# Altium schematic sheet 07_PCIE_WIFI.SchDoc
size 386 x 246 mm
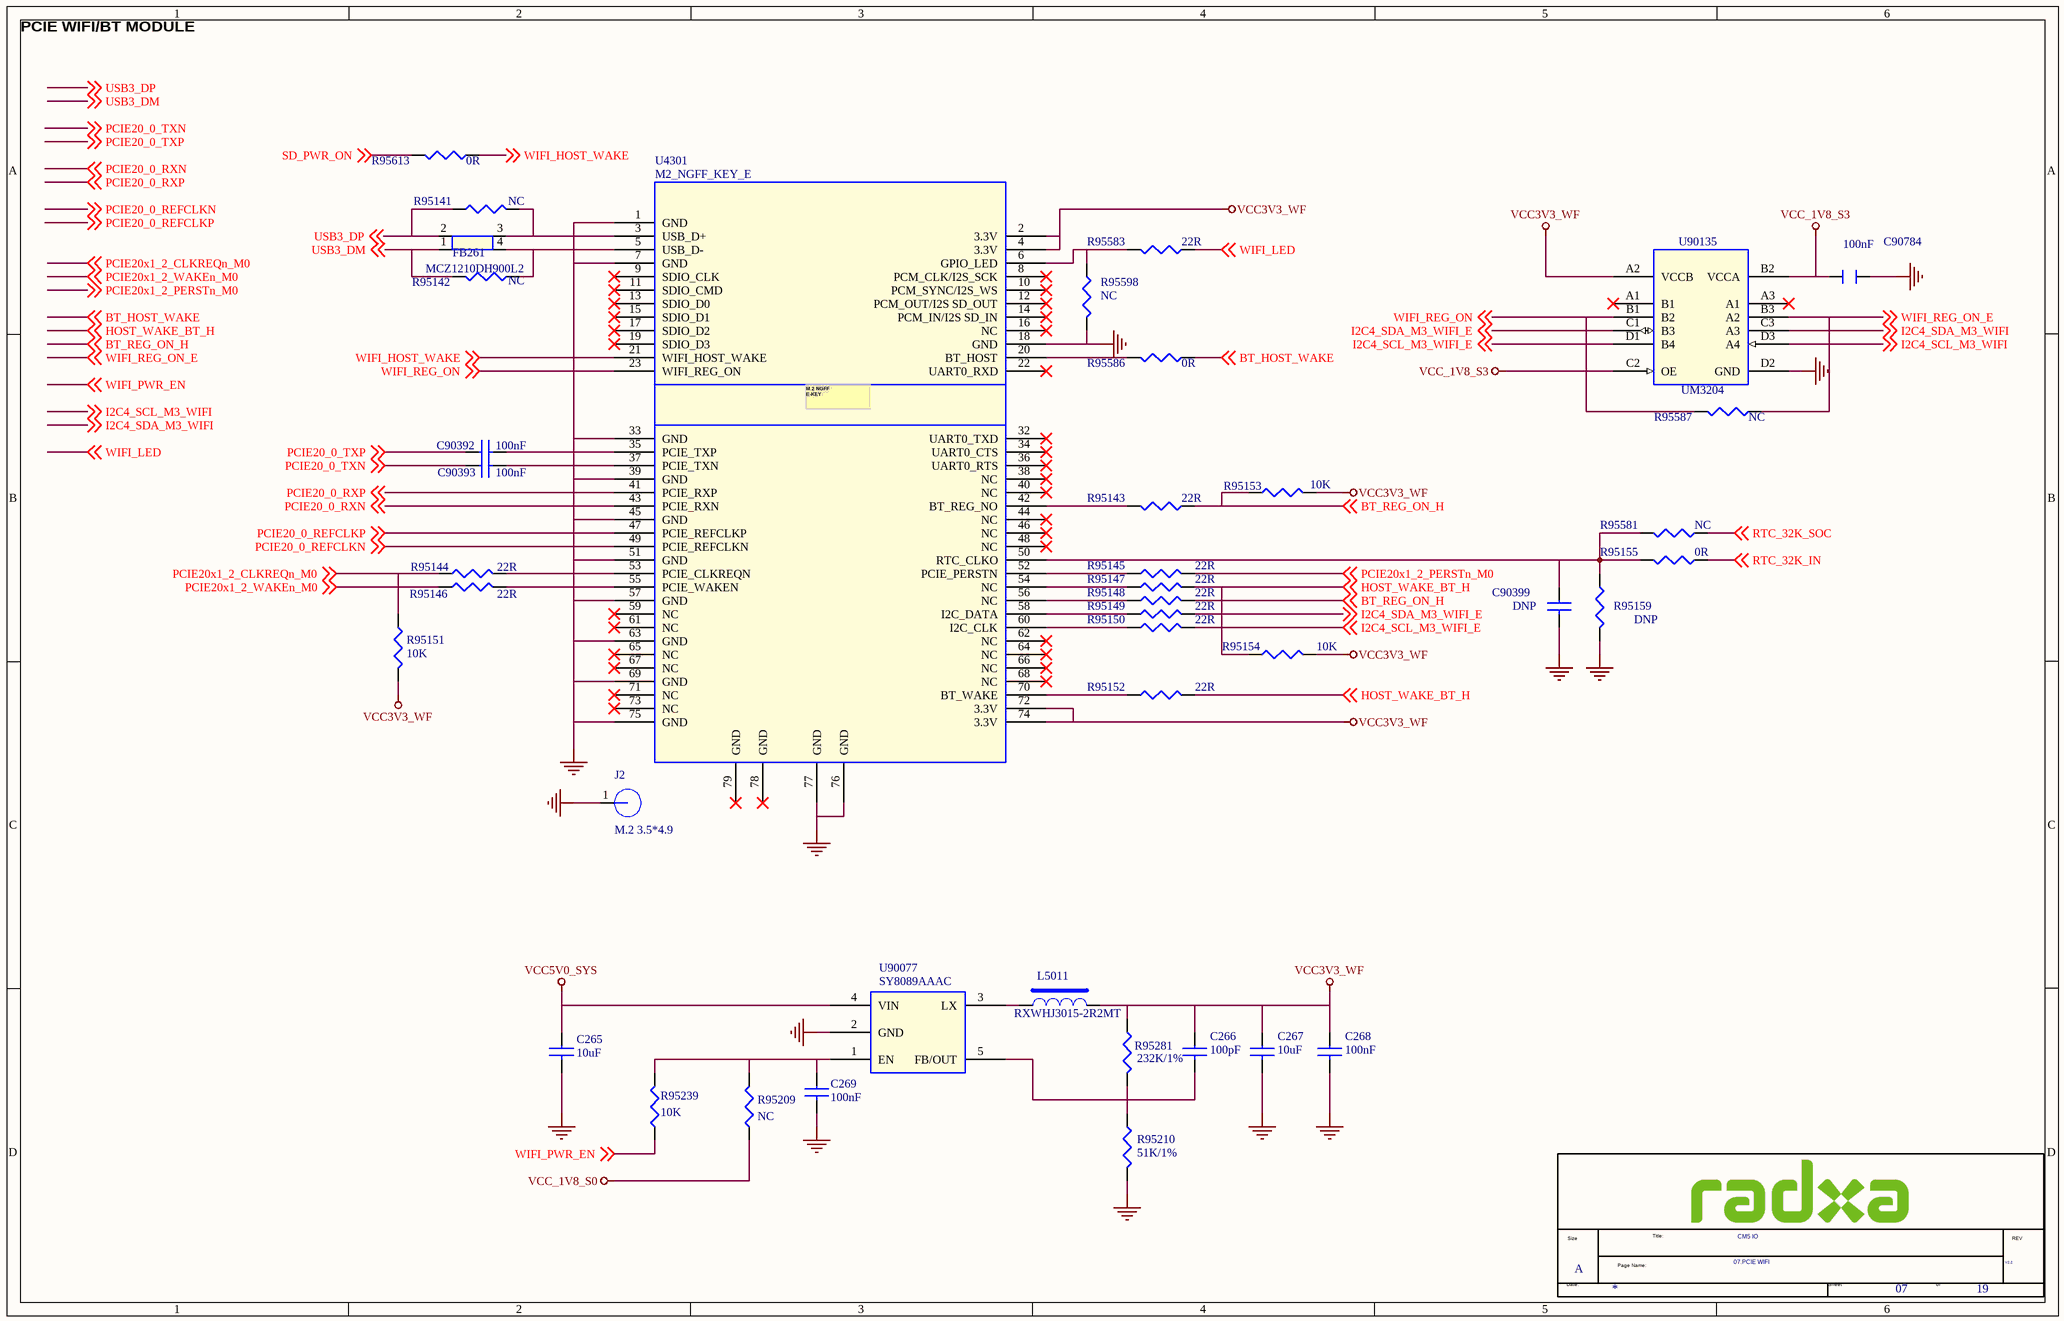
[diagram p0: 07_PCIE_WIFI.SchDoc]

## Parts
*  Doc: 07.PCIE WIFI  RevCode: V2.2  Title: CM5 IO  Page Size: A  Page Number: 07  Page Count: 19  (hidden comment: radxa_1010)  (graphical)
C265  10uF  [C0603]
C266  100pF  [C0201]
C267  10uF  [C0603]
C268  100nF  [C0201]
C269  100nF  [C0201]
C90392  100nF  [C0201]
C90393  100nF  [C0201]
C90399  DNP  [C0402]
C90784  100nF  [C0402]
FB261  MCZ1210DH900L2  [MCZ1210AH900L2]
J2  M.2 3.5*4.9  [H3.8MM]
L5011  RXWHJ3015-2R2MT  [IND_303015]
R95141  NC  [R0402]
R95142  NC  [R0402]
R95143  22R  [R0402]
R95144  22R  [R0402]
R95145  22R  [R0402]
R95146  22R  [R0402]
R95147  22R  [R0402]
R95148  22R  [R0402]
R95149  22R  [R0402]
R95150  22R  [R0402]
R95151  10K  [R0402]
R95152  22R  [R0402]
R95153  10K  [R0402]
R95154  10K  [R0402]
R95155  0R  [R0402]
R95159  DNP  [R0402]
R95209  NC  [R0402]
R95210  51K/1%  [R0402]
R95239  10K  [R0402]
R95281  232K/1%  [R0402]
R95581  NC  [R0402]
R95583  22R  [R0402]
R95586  0R  [R0402]
R95587  NC  [R0402]
R95598  NC  [R0402]
R95613  0R  [R0402]
U4301  M2_NGFF_KEY_E  [M2_NGFF_KEY_E_1]
U90077  SY8089AAAC  [SOT_23_5]
U90135  UM3204  [CSP-12]

## Nets
GND: C265.2 C267.2 C268.2 C269.2 C90399.2 C90784.1 J2.1 R95159.2 R95210.2 R95598.2 U4301.1(GND) U4301.7(GND) U4301.18(GND) U4301.33(GND) U4301.39(GND) U4301.45(GND) U4301.51(GND) U4301.57(GND) U4301.63(GND) U4301.69(GND) U4301.75(GND) U4301.76(GND) U4301.77(GND) U90077.2(GND) U90135.D2(GND)
VCC3V3_WF: C266.1 C267.1 C268.1 L5011.2 R95151.2 R95153.2 R95154.2 R95281.1 U4301.2(3.3V) U4301.4(3.3V) U4301.72(3.3V) U4301.74(3.3V) U90135.A2(VCCB)
VCC5V0_SYS: C265.1 U90077.4(VIN)
VCC_1V8_S0: R95209.1
VCC_1V8_S3: C90784.2 U90135.B2(VCCA) U90135.C2(OE)
BT_HOST_WAKE: R95586.1 ; off-sheet BT_HOST_WAKE
BT_REG_ON_H: R95143.1 R95148.1 R95153.1 ; off-sheet BT_REG_ON_H
HOST_WAKE_BT_H: R95147.1 R95152.1 R95154.1 ; off-sheet HOST_WAKE_BT_H
I2C4_SCL_M3_WIFI: U90135.D3(A4) ; off-sheet I2C4_SCL_M3_WIFI
I2C4_SCL_M3_WIFI_E: R95150.1 U90135.D1(B4) ; off-sheet I2C4_SCL_M3_WIFI_E
I2C4_SDA_M3_WIFI: U90135.C3(A3) ; off-sheet I2C4_SDA_M3_WIFI
I2C4_SDA_M3_WIFI_E: R95149.1 U90135.C1(B3) ; off-sheet I2C4_SDA_M3_WIFI_E
PCIE20_0_REFCLKN: U4301.49(PCIE_REFCLKN) ; off-sheet PCIE20_0_REFCLKN
PCIE20_0_REFCLKP: U4301.47(PCIE_REFCLKP) ; off-sheet PCIE20_0_REFCLKP
PCIE20_0_RXN: U4301.43(PCIE_RXN) ; off-sheet PCIE20_0_RXN
PCIE20_0_RXP: U4301.41(PCIE_RXP) ; off-sheet PCIE20_0_RXP
PCIE20_0_TXN: C90393.1 ; off-sheet PCIE20_0_TXN
PCIE20_0_TXP: C90392.1 ; off-sheet PCIE20_0_TXP
PCIE20x1_2_CLKREQn_M0: R95144.1 R95151.1 ; off-sheet PCIE20x1_2_CLKREQn_M0
PCIE20x1_2_PERSTn_M0: R95145.1 ; off-sheet PCIE20x1_2_PERSTn_M0
PCIE20x1_2_WAKEn_M0: R95146.1 ; off-sheet PCIE20x1_2_WAKEn_M0
RTC_32K_IN: R95155.1 ; off-sheet RTC_32K_IN
RTC_32K_SOC: R95581.1 ; off-sheet RTC_32K_SOC
SD_PWR_ON: R95613.2 ; off-sheet SD_PWR_ON
USB3_DM: FB261.1 R95142.2 ; off-sheet USB3_DM
USB3_DP: FB261.2 R95141.2 ; off-sheet USB3_DP
WIFI_HOST_WAKE: R95613.1 U4301.21(WIFI_HOST_WAKE) ; off-sheet WIFI_HOST_WAKE
WIFI_LED: R95583.1 ; off-sheet WIFI_LED
WIFI_PWR_EN: R95239.1 ; off-sheet WIFI_PWR_EN
WIFI_REG_ON: R95587.2 U4301.23(WIFI_REG_ON) U90135.B1(B2) ; off-sheet WIFI_REG_ON
WIFI_REG_ON_E: R95587.1 U90135.B3(A2) ; off-sheet WIFI_REG_ON_E
NetC266_2: C266.2 R95210.1 R95281.2 U90077.5(FB/OUT)
NetC269_1: C269.1 R95209.2 R95239.2 U90077.1(EN)
NetC90392_2: C90392.2 U4301.35(PCIE_TXP)
NetC90393_2: C90393.2 U4301.37(PCIE_TXN)
NetC90399_1: C90399.1 R95155.2 R95159.1 R95581.2 U4301.50(RTC_CLKO)
NetFB261_3: FB261.3 R95141.1 U4301.3(USB_D+)
NetFB261_4: FB261.4 R95142.1 U4301.5(USB_D-)
NetL5011_1: L5011.1 U90077.3(LX)
NetR95143_2: R95143.2 U4301.42(BT_REG_NO)
NetR95144_2: R95144.2 U4301.53(PCIE_CLKREQN)
NetR95145_2: R95145.2 U4301.52(PCIE_PERSTN)
NetR95146_2: R95146.2 U4301.55(PCIE_WAKEN)
NetR95147_2: R95147.2 U4301.54(NC)
NetR95148_2: R95148.2 U4301.56(NC)
NetR95149_2: R95149.2 U4301.58(I2C_DATA)
NetR95150_2: R95150.2 U4301.60(I2C_CLK)
NetR95152_2: R95152.2 U4301.70(BT_WAKE)
NetR95583_2: R95583.2 R95598.1 U4301.6(GPIO_LED)
NetR95586_2: R95586.2 U4301.20(BT_HOST)

Not connected (* = marked no-connect by the designer): U4301 8(PCM_CLK/I2S_SCK)* 9(SDIO_CLK)* 10(PCM_SYNC/I2S_WS)* 11(SDIO_CMD)* 12(PCM_OUT/I2S_SD_OUT)* 13(SDIO_D0)* 14(PCM_IN/I2S_SD_IN)* 15(SDIO_D1)* 16(NC)* 17(SDIO_D2)* 19(SDIO_D3)* 22(UART0_RXD)* 32(UART0_TXD)* 34(UART0_CTS)* 36(UART0_RTS)* 38(NC)* 40(NC)* 44(NC)* 46(NC)* 48(NC)* 59(NC)* 61(NC)* 62(NC)* 64(NC)* 65(NC)* 66(NC)* 67(NC)* 68(NC)* 71(NC)* 73(NC)* 78(GND)* 79(GND)*; U90135 A1(B1)* A3(A1)*

## Notes on the sheet
- PCIE WIFI/BT MODULE
- (in symbol M_8.2 NGFF EKEY SOCKET) M.2 NGFF / E-KEY
- (in symbol radxa_1010) Size; Title:; REV; Page Name:; Date:; Sheet; of

## Library data of the parts
C265 C267 = CAP NP_0_Dup5: cap,10.00uF,+/-10%,10V,X5R,C0805; Manufacturer: TDK; Voltage: 6.3V; RK PN: C2012X5R1A106K125AB; Priority: A; Tolerance: 10%; PCB Footprint: C0603; Dielectric: X5R; Part Type: C0805; Manufacturer PN: C2012X5R1A106K125AB; Created by: JJJ
C266 = CAP NP_0_Dup5: cap,100.00pF,+/-5%,50V,C0G,C0402; Manufacturer: TDK; Voltage: 25V; RK PN: C1005C0G1H101J050BA; Priority: A; Tolerance: 5%; PCB Footprint: C0201; Dielectric: C0G; Part Type: C0402; Manufacturer PN: C1005C0G1H101J050BA; Created by: JJJ
C268 = CAP NP_0_Dup5: cap,100.00nF,+/-10%,16V,X5R,C0402; Manufacturer: TDK; RK PN: C1005X5R1C104K050BA; Priority: A; Tolerance: 10%; Voltage: 16V; PCB Footprint: C0201; Dielectric: X5R; Part Type: C0402; Manufacturer PN: C1005X5R1C104K050BA; Created by: JJJ
C269 = CAP NP_0_Dup5: cap,100.00nF,+/-10%,16V,X5R,C0402; Manufacturer PN: C1005X5R1C104K050BA; Manufacturer: TDK; Tolerance: 10%; Priority: A; Voltage: 16V; PCB Footprint: C0201; Dielectric: X5R; Created by: JJJ; Part Type: C0402; RK PN: C1005X5R1C104K050BA
C90392 = CAP NP_0_Dup5: cap,100.00nF,+/-10%,10V,X5R,C0201; Manufacturer: TDK; RK PN: C0603X5R1A104K030BC; Priority: A; Tolerance: 10%; Voltage: 10V; PCB Footprint: C0201; Dielectric: X5R; Part Type: C0201; Manufacturer PN: C0603X5R1A104K030BC; Created by: JJJ
C90393 = CAP NP_0_Dup5: cap,100.00nF,+/-10%,10V,X5R,C0201; Manufacturer PN: C0603X5R1A104K030BC; Manufacturer: TDK; Tolerance: 10%; Priority: A; Voltage: 10V; PCB Footprint: C0201; Dielectric: X5R; Created by: JJJ; Part Type: C0201; RK PN: C0603X5R1A104K030BC
C90399 = CAP NP_0_Dup5: Did Not Place.; Manufacturer PN: DNPC0402; Priority: A; PCB Footprint: C0402; Created by: JJJ; Part Type: DNP; RK PN: DNPC0402; Option: DNP
C90784 = CAPACITOR_0: PAGE: 1; PCB Footprint: C0402
FB261 = MCZ1210AH900L2_1_Dup1: PCB Footprint: MCZ1210AH900L2
J2 = HOLE: 直径3.5mm hole; PCB Footprint: HOLE_D5_3D; RK PN: HOLE_3R50; Priority: A; Part Type: HOLE; Created by: CZD
L5011 = INDUCTORS OF FERRITE_Dup1: Power Inductor,2.2uH,0.3,IND_303015; Manufacturer PN: SWPA3015S2R2NT; Manufacturer: sunlord; DC Resistor: 0.06ohm; Isat: 1.6A; Resonace frequency: 86M; Tolerance: 30%; Priority: A; PCB Footprint: IND_303015; Created by: YTL; Irms: 1.6A; Part Type: POWER_IND; RK PN: SWPA3015S2R2NT
R95141 = RESISTOR_0_Dup2: 通用厚膜电阻,33R,+/-5%,R0402,1/16W.; Manufacturer: YAGEO; PCB Footprint: R0201; Tolerance: 5%; RK PN: RC0402JR-0733RL; Priority: A; Wattage: 1/16W; Part Type: 通用厚膜电阻; Manufacturer PN: RC0402JR-0733RL; Created by: YTL
R95142 = RESISTOR_0_Dup2: 通用厚膜电阻,33R,+/-5%,R0402,1/16W.; Manufacturer PN: RC0402JR-0733RL; Manufacturer: YAGEO; PCB Footprint: R0201; Tolerance: 5%; Wattage: 1/16W; Priority: A; Created by: YTL; Part Type: 通用厚膜电阻; RK PN: RC0402JR-0733RL
R95143 R95147 R95150 R95586 R95598 = RESISTOR_0_Dup2: 通用厚膜电阻,22R,+/-5%,R0402,1/16W.; Manufacturer: YAGEO; PCB Footprint: R0201; Tolerance: 5%; RK PN: RC0402JR-0722RL; Priority: A; Wattage: 1/16W; Part Type: 通用厚膜电阻; Manufacturer PN: RC0402JR-0722RL; Created by: YTL
R95144 R95146 = RESISTOR_0_Dup2: 通用厚膜电阻,22R,+/-5%,R0402,1/16W.; Manufacturer: YAGEO; Tolerance: 5%; RK PN: RC0402JR-0722RL; Priority: A; Wattage: 1/16W; PCB Footprint: R0402; Part Type: 通用厚膜电阻; Manufacturer PN: RC0402JR-0722RL; Created by: YTL
R95145 R95613 = RESISTOR_0_Dup2: 通用厚膜电阻,22R,+/-5%,R0402,1/16W.; Manufacturer PN: RC0402JR-0722RL; Manufacturer: YAGEO; Tolerance: 5%; Wattage: 1/16W; Priority: A; PCB Footprint: R0402; Created by: YTL; Part Type: 通用厚膜电阻; RK PN: RC0402JR-0722RL
R95148 R95149 R95152 R95583 R95587 = RESISTOR_0_Dup2: 通用厚膜电阻,22R,+/-5%,R0402,1/16W.; Manufacturer PN: RC0402JR-0722RL; Manufacturer: YAGEO; PCB Footprint: R0201; Tolerance: 5%; Wattage: 1/16W; Priority: A; Created by: YTL; Part Type: 通用厚膜电阻; RK PN: RC0402JR-0722RL
R95151 R95209 R95239 = RESISTOR_0_Dup2: 通用厚膜电阻,10K,+/-5%,R0402,1/16W.; Manufacturer: YAGEO; PCB Footprint: R0201; Tolerance: 5%; RK PN: RC0402JR-0710KL; Priority: A; Wattage: 1/16W; Part Type: 通用厚膜电阻; Manufacturer PN: RC0402JR-0710KL; Created by: YTL
R95153 R95154 = RESISTOR_0_Dup2: 通用厚膜电阻,10K,+/-5%,R0402,1/16W.; Manufacturer PN: RC0402JR-0710KL; Manufacturer: YAGEO; PCB Footprint: R0201; Tolerance: 5%; Option: DNP; Wattage: 1/16W; Priority: A; Created by: YTL; Part Type: 通用厚膜电阻; RK PN: RC0402JR-0710KL
R95155 = RESISTOR_0_Dup2: 通用厚膜电阻,0R,+/-5%,R0402,1/16W.; Manufacturer PN: RC0402JR-070RL; Manufacturer: YAGEO; Tolerance: 5%; Wattage: 1/16W; Priority: A; PCB Footprint: R0402; Created by: YTL; Part Type: 通用厚膜电阻; RK PN: RC0402JR-070RL
R95159 = RESISTOR_0_Dup2: Did Not Place.; RK PN: DNPR0402; Priority: A; PCB Footprint: R0402; Part Type: DNP; Manufacturer PN: DNPR0402; Created by: JJJ
R95210 = RESISTOR_0_Dup2: 通用厚膜电阻,47K,+/-1%,R0402,1/16W.; Manufacturer: YAGEO; PCB Footprint: R0201; Tolerance: 1%; RK PN: RC0402FR-0747KL; Priority: A; Wattage: 1/16W; Part Type: 通用厚膜电阻; Manufacturer PN: RC0402FR-0747KL; Created by: YTL
R95281 = RESISTOR_0_Dup2: 通用厚膜电阻,200K,+/-1%,R0402,1/16W.; Manufacturer PN: RC0402FR-07200KL; Manufacturer: YAGEO; PCB Footprint: R0201; Tolerance: 1%; Wattage: 1/16W; Priority: A; Created by: YTL; Part Type: 通用厚膜电阻; RK PN: RC0402FR-07200KL
R95581 = RESISTOR_0_Dup2: 通用厚膜电阻,0R,+/-5%,R0402,1/16W.; Manufacturer: YAGEO; Tolerance: 5%; RK PN: RC0402JR-070RL; Priority: A; Wattage: 1/16W; PCB Footprint: R0402; Part Type: 通用厚膜电阻; Manufacturer PN: RC0402JR-070RL; Created by: YTL
U4301 = M_8.2 NGFF EKEY SOCKET: PCB Footprint: M2_NGFF_KEY_E_1
U90077 = DCDC_SY8088: High Efficiency 5.5V, 2A continuous, 3A peak, 1MHz Synchronous Step Down Regulator; Manufacturer PN: SY8089AAC; Manufacturer: Silergy（矽力杰）; Priority: A; Option: /CE8514B-2A; PCB Footprint: SOT_23_5; Created by: JJJ; Part Type: DCDC; RK PN: SY8089AAC
U90135 = MP2610_0: 4-bit Bi-directional Level Shifter  UM3204H; Part Number: PI4ULS5V104GAEX; Vendor: PERICOM; PCB Footprint: CSP-12
* = radxa_1010: Page Create Date: March  8, 1995; Page Modify Date: *